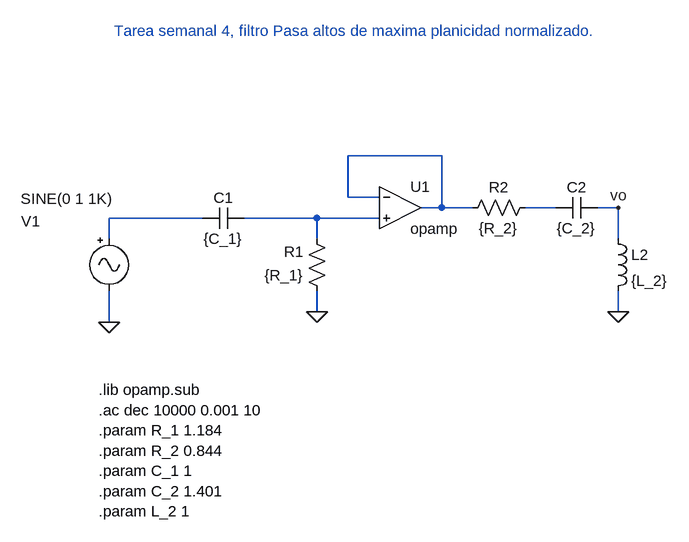
[diagram p0: schematic ts4.asc]
ts4.asc, the LTspice schematic file:
Version 4
SHEET 1 900 720
WIRE 544 192 400 192
WIRE 400 256 400 192
WIRE 448 256 400 256
WIRE 544 272 544 192
WIRE 544 272 512 272
WIRE 592 272 544 272
WIRE 720 272 672 272
WIRE 816 272 784 272
WIRE 176 288 32 288
WIRE 352 288 240 288
WIRE 448 288 352 288
WIRE 32 320 32 288
WIRE 352 320 352 288
WIRE 816 320 816 272
WIRE 352 432 352 400
WIRE 816 432 816 400
WIRE 32 448 32 400
FLAG 352 432 0
FLAG 816 432 0
FLAG 32 448 0
FLAG 816 272 vo
SYMBOL Opamps/opamp 480 208 R0
SYMATTR InstName U1
SYMBOL res 368 416 R180
WINDOW 0 36 76 Left 2
WINDOW 3 36 40 Left 2
SYMATTR InstName R1
SYMATTR Value {R_1}
SYMBOL res 688 256 R90
WINDOW 0 0 56 VBottom 2
WINDOW 3 32 56 VTop 2
SYMATTR InstName R2
SYMATTR Value {R_2}
SYMBOL ind 800 304 R0
SYMATTR InstName L2
SYMATTR Value {L_2}
SYMBOL cap 784 288 M270
WINDOW 0 32 32 VTop 2
WINDOW 3 0 32 VBottom 2
SYMATTR InstName C2
SYMATTR Value {C_2}
SYMBOL cap 176 304 R270
WINDOW 0 32 32 VTop 2
WINDOW 3 0 32 VBottom 2
SYMATTR InstName C1
SYMATTR Value {C_1}
SYMBOL Misc/signal 32 304 R0
WINDOW 0 -135 -11 Left 2
WINDOW 3 -136 -46 Left 2
SYMATTR InstName V1
SYMATTR Value2 AC 1
TEXT 16 552 Left 2 !.lib opamp.sub\n.ac dec 10000 0.001 10\n.param R_1 1.184\n.param R_2 0.844\n.param C_1 1\n.param C_2 1.401\n.param L_2 1
TEXT 40 0 Left 2 ;Tarea semanal 4, filtro Pasa altos de maxima planicidad normalizado.

The netlist it stands for:
* ts4.asc
XU1 N001 N004 N001 opamp Aol=100K GBW=10Meg  ; pins invin noninvin out
R1 0 N004 {R_1}
R2 N002 N001 {R_2}
L2 vo 0 {L_2}
C2 vo N002 {C_2}
C1 N003 N004 {C_1}
V1 N003 0 SINE(0 1 1K) AC 1
.lib opamp.sub
.ac dec 10000 0.001 10
.param R_1 1.184
.param R_2 0.844
.param C_1 1
.param C_2 1.401
.param L_2 1
* Tarea semanal 4, filtro Pasa altos de maxima planicidad normalizado.
.backanno
.end